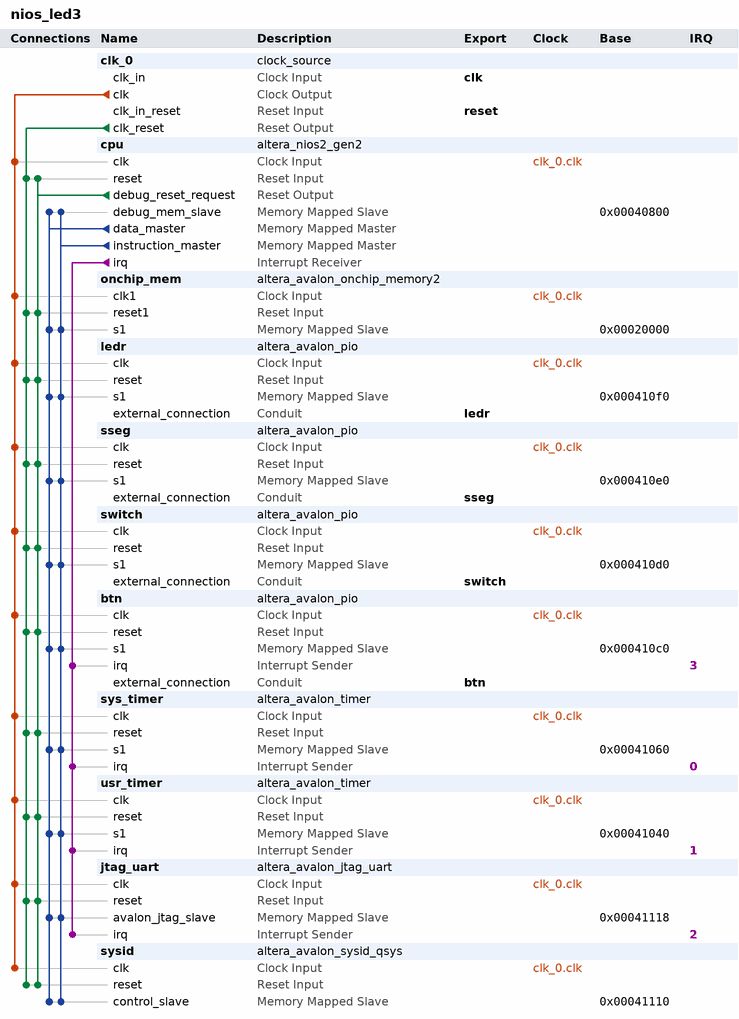
[diagram p0: system contents]
# Platform Designer (Qsys) system nios_led3, Cyclone V 5CSEMA5F31C6
# Parameters at their usual value, and those the tool derives, are not listed.
package require -exact qsys 21.1
create_system nios_led3
set_project_property DEVICE_FAMILY {Cyclone V}
set_project_property DEVICE 5CSEMA5F31C6

add_instance clk_0 clock_source 21.1
set_instance_parameter_value clk_0 clockFrequency 50000000

add_instance cpu altera_nios2_gen2 21.1
set_instance_parameter_value cpu dcache_size 2048
set_instance_parameter_value cpu exceptionSlave onchip_mem.s1
set_instance_parameter_value cpu icache_size 4096
set_instance_parameter_value cpu impl Tiny
set_instance_parameter_value cpu resetSlave onchip_mem.s1

add_instance onchip_mem altera_avalon_onchip_memory2 21.1
set_instance_parameter_value onchip_mem dataWidth 32
set_instance_parameter_value onchip_mem dualPort false
set_instance_parameter_value onchip_mem initMemContent true
set_instance_parameter_value onchip_mem initializationFileName onchip_mem.hex
set_instance_parameter_value onchip_mem memorySize 131072

add_instance ledr altera_avalon_pio 21.1
set_instance_parameter_value ledr direction Output
set_instance_parameter_value ledr width 10

add_instance sseg altera_avalon_pio 21.1
set_instance_parameter_value sseg direction Output
set_instance_parameter_value sseg width 32

add_instance switch altera_avalon_pio 21.1
set_instance_parameter_value switch direction Input
set_instance_parameter_value switch width 10

add_instance btn altera_avalon_pio 21.1
set_instance_parameter_value btn captureEdge true
set_instance_parameter_value btn direction Input
set_instance_parameter_value btn edgeType FALLING
set_instance_parameter_value btn generateIRQ true
set_instance_parameter_value btn width 4

add_instance sys_timer altera_avalon_timer 21.1
set_instance_parameter_value sys_timer period 1
set_instance_parameter_value sys_timer periodUnits MSEC

add_instance usr_timer altera_avalon_timer 21.1
set_instance_parameter_value usr_timer period 1
set_instance_parameter_value usr_timer periodUnits MSEC

add_instance jtag_uart altera_avalon_jtag_uart 21.1
set_instance_parameter_value jtag_uart simInteractiveOptions NO_INTERACTIVE_WINDOWS

add_instance sysid altera_avalon_sysid_qsys 21.1
set_instance_parameter_value sysid id 0

# connections
add_connection clk_0.clk btn.clk clock
add_connection clk_0.clk cpu.clk clock
add_connection clk_0.clk jtag_uart.clk clock
add_connection clk_0.clk ledr.clk clock
add_connection clk_0.clk onchip_mem.clk1 clock
add_connection clk_0.clk sseg.clk clock
add_connection clk_0.clk switch.clk clock
add_connection clk_0.clk sys_timer.clk clock
add_connection clk_0.clk sysid.clk clock
add_connection clk_0.clk usr_timer.clk clock
add_connection clk_0.clk_reset btn.reset reset
add_connection clk_0.clk_reset cpu.reset reset
add_connection clk_0.clk_reset jtag_uart.reset reset
add_connection clk_0.clk_reset ledr.reset reset
add_connection clk_0.clk_reset onchip_mem.reset1 reset
add_connection clk_0.clk_reset sseg.reset reset
add_connection clk_0.clk_reset switch.reset reset
add_connection clk_0.clk_reset sys_timer.reset reset
add_connection clk_0.clk_reset sysid.reset reset
add_connection clk_0.clk_reset usr_timer.reset reset
add_connection cpu.debug_reset_request btn.reset reset
add_connection cpu.debug_reset_request cpu.reset reset
add_connection cpu.debug_reset_request jtag_uart.reset reset
add_connection cpu.debug_reset_request ledr.reset reset
add_connection cpu.debug_reset_request onchip_mem.reset1 reset
add_connection cpu.debug_reset_request sseg.reset reset
add_connection cpu.debug_reset_request switch.reset reset
add_connection cpu.debug_reset_request sys_timer.reset reset
add_connection cpu.debug_reset_request sysid.reset reset
add_connection cpu.debug_reset_request usr_timer.reset reset
add_connection cpu.data_master btn.s1 avalon
set_connection_parameter_value cpu.data_master/btn.s1 baseAddress 0x000410c0
add_connection cpu.data_master cpu.debug_mem_slave avalon
set_connection_parameter_value cpu.data_master/cpu.debug_mem_slave baseAddress 0x00040800
add_connection cpu.data_master jtag_uart.avalon_jtag_slave avalon
set_connection_parameter_value cpu.data_master/jtag_uart.avalon_jtag_slave baseAddress 0x00041118
add_connection cpu.data_master ledr.s1 avalon
set_connection_parameter_value cpu.data_master/ledr.s1 baseAddress 0x000410f0
add_connection cpu.data_master onchip_mem.s1 avalon
set_connection_parameter_value cpu.data_master/onchip_mem.s1 baseAddress 0x00020000
add_connection cpu.data_master sseg.s1 avalon
set_connection_parameter_value cpu.data_master/sseg.s1 baseAddress 0x000410e0
add_connection cpu.data_master switch.s1 avalon
set_connection_parameter_value cpu.data_master/switch.s1 baseAddress 0x000410d0
add_connection cpu.data_master sys_timer.s1 avalon
set_connection_parameter_value cpu.data_master/sys_timer.s1 baseAddress 0x00041060
add_connection cpu.data_master sysid.control_slave avalon
set_connection_parameter_value cpu.data_master/sysid.control_slave baseAddress 0x00041110
add_connection cpu.data_master usr_timer.s1 avalon
set_connection_parameter_value cpu.data_master/usr_timer.s1 baseAddress 0x00041040
add_connection cpu.instruction_master btn.s1 avalon
set_connection_parameter_value cpu.instruction_master/btn.s1 baseAddress 0x000410c0
add_connection cpu.instruction_master cpu.debug_mem_slave avalon
set_connection_parameter_value cpu.instruction_master/cpu.debug_mem_slave baseAddress 0x00040800
add_connection cpu.instruction_master jtag_uart.avalon_jtag_slave avalon
set_connection_parameter_value cpu.instruction_master/jtag_uart.avalon_jtag_slave baseAddress 0x00041118
add_connection cpu.instruction_master ledr.s1 avalon
set_connection_parameter_value cpu.instruction_master/ledr.s1 baseAddress 0x000410f0
add_connection cpu.instruction_master onchip_mem.s1 avalon
set_connection_parameter_value cpu.instruction_master/onchip_mem.s1 baseAddress 0x00020000
add_connection cpu.instruction_master sseg.s1 avalon
set_connection_parameter_value cpu.instruction_master/sseg.s1 baseAddress 0x000410e0
add_connection cpu.instruction_master switch.s1 avalon
set_connection_parameter_value cpu.instruction_master/switch.s1 baseAddress 0x000410d0
add_connection cpu.instruction_master sys_timer.s1 avalon
set_connection_parameter_value cpu.instruction_master/sys_timer.s1 baseAddress 0x00041060
add_connection cpu.instruction_master sysid.control_slave avalon
set_connection_parameter_value cpu.instruction_master/sysid.control_slave baseAddress 0x00041110
add_connection cpu.instruction_master usr_timer.s1 avalon
set_connection_parameter_value cpu.instruction_master/usr_timer.s1 baseAddress 0x00041040
add_connection cpu.irq btn.irq interrupt
set_connection_parameter_value cpu.irq/btn.irq irqNumber 3
add_connection cpu.irq jtag_uart.irq interrupt
set_connection_parameter_value cpu.irq/jtag_uart.irq irqNumber 2
add_connection cpu.irq sys_timer.irq interrupt
set_connection_parameter_value cpu.irq/sys_timer.irq irqNumber 0
add_connection cpu.irq usr_timer.irq interrupt
set_connection_parameter_value cpu.irq/usr_timer.irq irqNumber 1

# exported interfaces
add_interface btn conduit end
set_interface_property btn EXPORT_OF btn.external_connection
add_interface clk clock sink
set_interface_property clk EXPORT_OF clk_0.clk_in
add_interface ledr conduit end
set_interface_property ledr EXPORT_OF ledr.external_connection
add_interface reset reset sink
set_interface_property reset EXPORT_OF clk_0.clk_in_reset
add_interface sseg conduit end
set_interface_property sseg EXPORT_OF sseg.external_connection
add_interface switch conduit end
set_interface_property switch EXPORT_OF switch.external_connection

set_interconnect_requirement {$system} qsys_mm.clockCrossingAdapter HANDSHAKE
set_interconnect_requirement {$system} qsys_mm.enableEccProtection FALSE
set_interconnect_requirement {$system} qsys_mm.insertDefaultSlave FALSE
set_interconnect_requirement {$system} qsys_mm.maxAdditionalLatency 1

save_system nios_led3.qsys
